# EAGLE design sigfox_pcb (EAGLE 9.5.2)
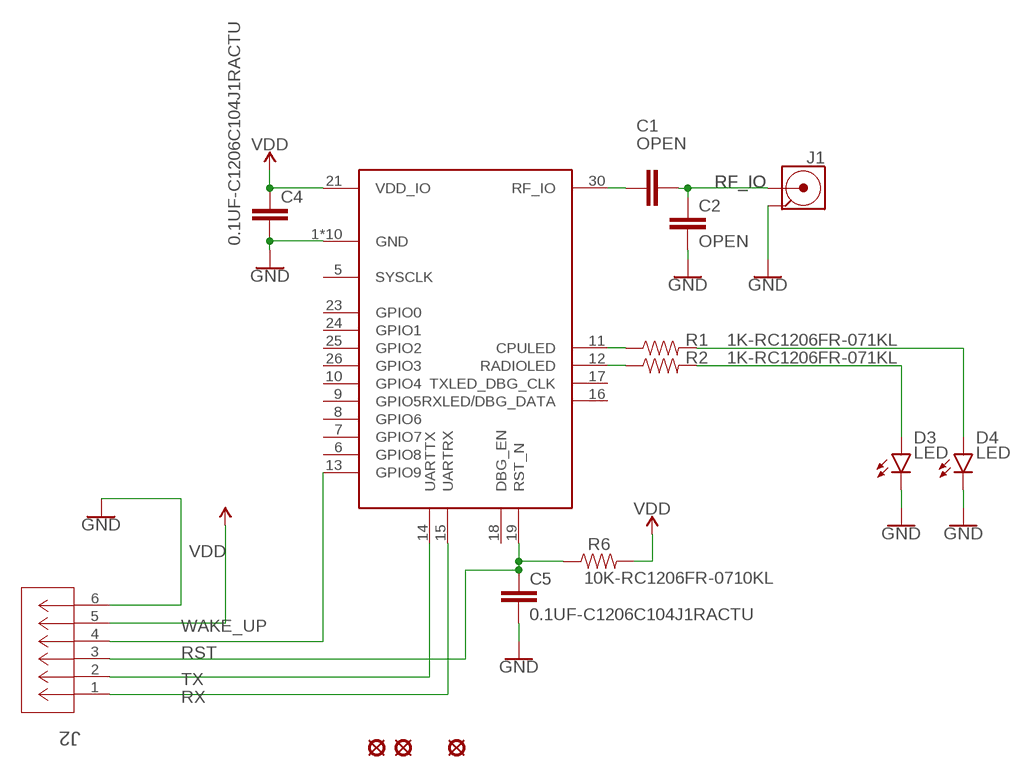
[diagram p0: schematic, sheet 1]

## Parts
C1  OPEN  [C1206_OPEN]
C2  OPEN  [C1206_OPEN]
C4  0.1UF-C1206C104J1RACTU  [C1206]
C5  0.1UF-C1206C104J1RACTU  [C1206]
D3  LED  [LED1206]
D4  LED  [LED1206]
H1  HOLE-M3  [HOLE_3.0]
H2  HOLE-M3  [HOLE_3.0]
H4  HOLE-M3  [HOLE_3.0]
J1  SMA-142-0701-801  [142-0701-801]
J2  SSW-106-02-G-S-RA  [CON6_1X6_TR_SSQ]
R1  1K-RC1206FR-071KL  [R1206]
R2  1K-RC1206FR-071KL  [R1206]
R6  10K-RC1206FR-0710KL  [R1206]
U1  SFM11R2D  [SFM11R2D]

## Nets
GND: C2.2 C4.2 C5.2 D3.K(C) D4.K(C) J1.2_1 J1.2_2 J1.3_1 J1.3_2 J2.6 U1.1(GND) U1.2(GND) U1.3(GND) U1.4(GND) U1.20(GND) U1.22(GND) U1.27(GND) U1.28(GND) U1.29(GND) U1.31(GND)
N$1: R1.1 U1.11(CPULED)
N$2: R2.1 U1.12(RADIOLED)
N$10: D3.A R2.2
N$11: D4.A R1.2
N$12: C1.1 U1.30(RF_IO)
RF_IO: C1.2 C2.1 J1.1
RST: C5.1 J2.3 R6.1 U1.19(RST_N)
RX: J2.1 U1.15(UARTRX)
TX: J2.2 U1.14(UARTTX)
VDD: C4.1 J2.5 R6.2 U1.21(VDD_IO)
WAKE_UP: J2.4 U1.13(GPIO9)
Unconnected: U1.5(SYSCLK) U1.6(GPIO8) U1.7(GPIO7) U1.8(GPIO6) U1.9(GPIO5) U1.10(GPIO4) U1.16(RXLED/DBG_DATA) U1.17(TXLED_DBG_CLK) U1.18(DBG_EN) U1.23(GPIO0) U1.24(GPIO1) U1.25(GPIO2) U1.26(GPIO3)

## Library data of the parts
C1 C2 = untitled-capacitors:OPEN
C4 C5 = untitled-capacitors:0.1UF: 0.1µF Ceramic Capacitor; DIGIKEY#: 399-9304-1-ND; MFR: KEMET; MFR#: C1206C104J1RACTU
D3 D4 = untitled-discretesemi:LED: LED Indication - Discrete Radial
H1 H2 H4 = untitled:HOLE: Hole
J1 = IFUNAM-Connectors:SMA: SMA Connector Jack, Female Socket 50 Ohm; DIGIKEY#: J502-ND; MFR: Cinch Connectivity Solutions Johnson; MFR#: 142-0701-801
J2 = SSW-106-02-G_S_RA:SSW-106-02-G-S-RA; BUILT_BY: EMA_UL_Team; MANUFACTURER_PART_NUMBER: SSW-106-02-G-S-RA; VENDOR: Samtec Inc
R1 R2 = untitled-resistors:1K: Resistor, 1 kohm; DIGIKEY#: 311-1.00KFRCT-ND; MFR: Yageo; MFR#: RC1206FR-071KL
R6 = untitled-resistors:10K: Resistor, 10 kohm; DIGIKEY#: 311-10.0KFRCT-ND; MFR: Yageo; MFR#: RC1206FR-0710KL
U1 = SFM11R2D:SFM11R2D

## Board
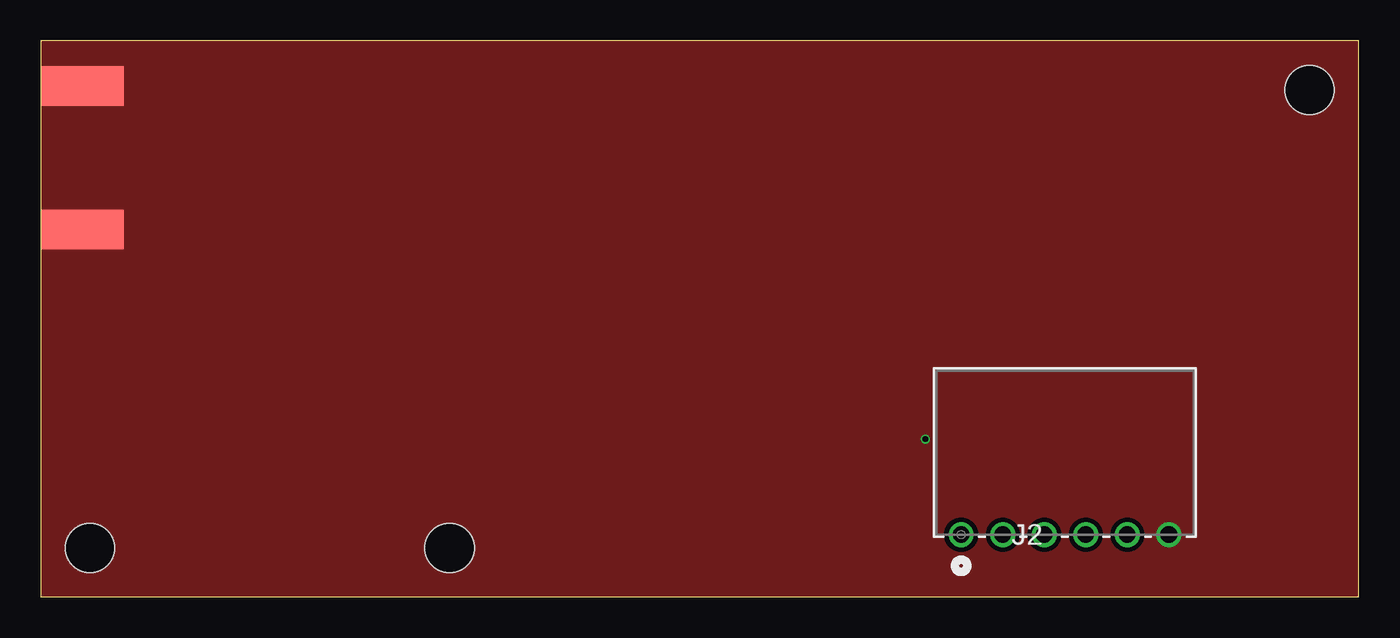
[diagram p1: board, top side]
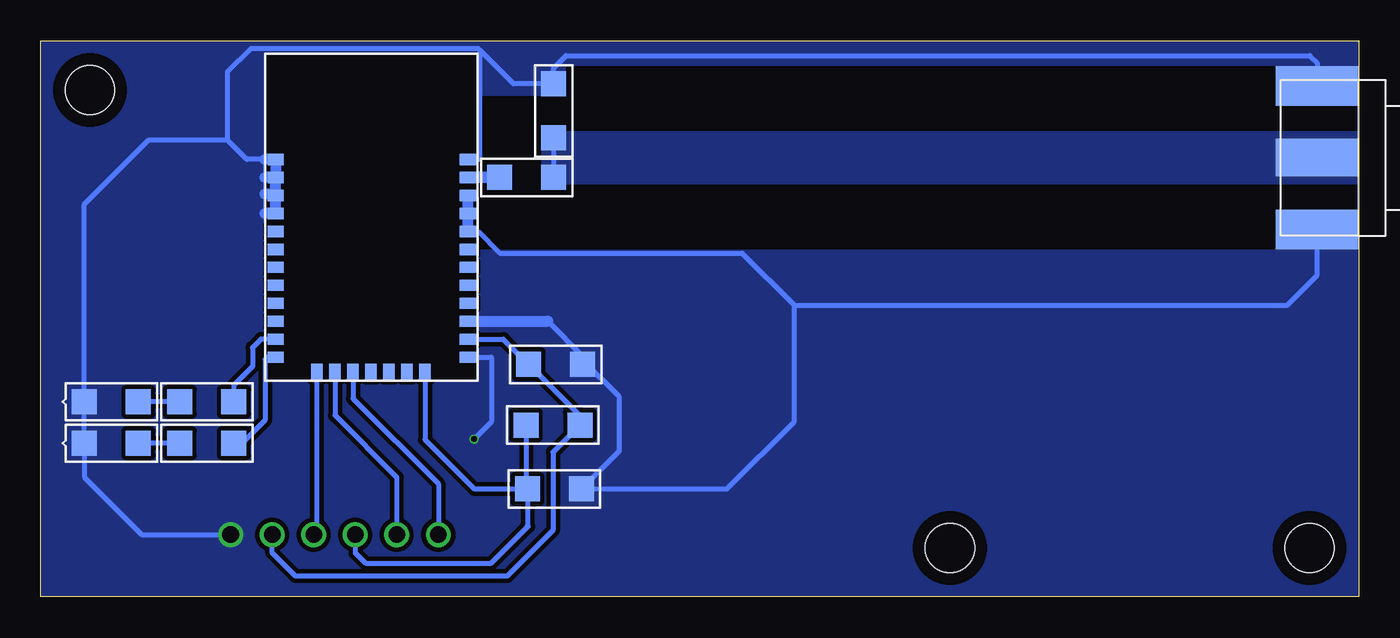
[diagram p2: board, bottom side, seen from below]

Size 80.6 x 34 mm. Coordinates in mm from the lower left corner, seen from the top.
Outline: 80.6,34 0,34 0,0 80.6,0 80.6,34
Copper layers (1*16): Top 0.035mm / dielectric 1.5mm / Bottom 0.035mm
Design rules "SeeedStudio_4layer_DRU_no_angle_20140221 *": minimum track width 5mil, minimum drill 12mil, track to track 11mil, track to pad 11mil, pad to pad 11mil, via to via 11mil, smd to smd 11mil, copper to edge 0mil, drill to drill 8mil, minimum pad ring 6mil, minimum via ring 4mil, stop-mask expansion 4mil, vias tented up to drill 25mil, thermal gap 10mil
bRestrict: area 0,13.2 to 66.9,33.2

### Footprints (pad centres in the part's own frame; a part is rotated, then mirrored left to right if it is on the bottom)
C1206_OPEN = smd 1.524 x 1.524: 1 -1.651,0; 2 1.651,0
C1206 = smd 1.524 x 1.524: 1 -1.651,0; 2 1.651,0
LED1206 = smd 1.524 x 1.524: A 1.651,0; K -1.651,0
HOLE_3.0 = hole 3: 0,0
142-0701-801 = smd 2.286 x 5.08: 1 0,2.54 | smd 2.413 x 5.08: 2_1 -4.381,2.54; 3_1 4.381,2.54 | smd 2.413 x 5.08 bottom: 2_2 -4.381,2.54; 3_2 4.381,2.54
CON6_1X6_TR_SSQ = drill 1.016 pad 1.524: 1 -6.35,0; 2 -3.81,0; 3 -1.27,0; 4 1.27,0; 5 3.81,0; 6 6.35,0
R1206 = smd 1.524 x 1.524: 1 -1.651,0; 2 1.651,0
SFM11R2D = smd 1 x 0.7: 1 0.65,13.55; 2 0.65,12.45; 3 0.65,11.35; 4 0.65,10.25; 5 0.65,9.15; 6 0.65,8.05; 7 0.65,6.95; 8 0.65,5.85; 9 0.65,4.75; 10 0.65,3.65; 11 0.65,2.55; 12 0.65,1.45; 20 12.4,1.45; 21 12.4,2.55; 22 12.4,3.65; 23 12.4,4.75; 24 12.4,5.85; 25 12.4,6.95; 26 12.4,8.05; 27 12.4,9.15; 28 12.4,10.25; 29 12.4,11.35; 30 12.4,12.45; 31 12.4,13.55 | smd 0.7 x 1: 13 3.18,0.56; 14 4.28,0.56; 15 5.38,0.56; 16 6.48,0.56; 17 7.58,0.56; 18 8.68,0.56; 19 9.78,0.56

### Placement (x,y rotation side)
C1  50.89,25.65 0 bottom
C2  49.24,29.72 90 bottom
C4  49.11,14.22 0 bottom
C5  49.19,6.6 0 bottom
D3  76.29,9.4 0 bottom
D4  76.29,11.94 0 bottom
H1  3,3 0 top
H2  77.6,31 0 top
H4  25,3 0 top
J1  0,26.86 90 bottom
J2  62.64,3.81 0 top
R1  70.45,11.94 180 bottom
R2  70.45,9.4 180 bottom
R6  49.28,10.5 0 bottom
U1  66.89,13.21 0 bottom

### Tracks (layer width: path | path; a pad name or v marks a point on that pad's centre or on a via)
GND  (via drill 0.35)
  Bottom 0.127: 66.9,23.46 66.9,24.64 66.9,25.65 66.9,26.76 | U1.2 | U1.3 66.32,24.64
  Bottom 0.152: D3.K 77.94,9.65
  Bottom 0.305: 47.46,14.48 C4.2 47.75,13.93 | 47.46,14.48 47.46,14.73 49.59,16.86 | U1.31 53.83,26.76 53.75,26.84 53.75,33.43 | U1.27 53.86,22.36 52.53,21.03 37.71,21.03 34.52,17.84 34.51,17.84 | 77.94,9.65 D4.K 77.94,24 74,27.94 69.19,27.94 | J1.3_2 2.54,32.66 2.97,33.1 48.48,33.1 49.24,32.34 C2.2 51.69,31.37 53.75,33.43 | 34.51,17.84 4.37,17.84 2.54,19.68 J1.2_2 | 34.51,17.84 34.51,10.72 38.63,6.6 C5.2 45.21,8.93 45.21,12.23 47.46,14.48 | 69.19,27.94 | 69.19,27.94 69.19,32.09 67.75,33.53 53.85,33.53 53.75,33.43 | 69.19,27.94 68.01,26.76 U1.1 | D3.K 77.94,7.33 74.42,3.81 J2.6 | U1.20 53.06,14.66 53.03,14.63 53.03,10.72 v54.1,9.65
  Bottom 0.686: U1.22 49.59,16.86 | U1.29 U1.28 U1.27 | 66.9,26.76 U1.1 U1.2 U1.3 U1.4 66.9,23.46 | U1.2 66.9,25.65 | 66.32,24.64 66.9,24.64
  pour Bottom (rank 2, no thermals): 80.6,0 0,0 0,34 80.6,34
  pour Top (no thermals): 0,34 0,0 80.6,0 80.6,34
N$1
  Bottom 0.305: U1.11 67.14,15.76 67.65,15.24 67.65,14.1 68.8,12.95 R1.1
N$2
  Bottom 0.305: U1.12 66.75,14.66 66.89,14.52 66.89,10.79 68.29,9.4 R2.1
N$10
  Bottom 0.305: R2.2 D3.A
N$11
  Bottom 0.305: R1.2 D4.A
N$12
  Bottom 0.305: U1.30
  Bottom 0.706: U1.30 C1.1
RF_IO
  Bottom 0.305: C2.1 C1.2
  pour Bottom (no thermals): 0,28.51 0,25.21 50,25.21 50,28.51
RST
  Bottom 0.305: 57.31,13.56 U1.19 57.11,9.61 54.1,6.6 C5.1 | R6.1 50.93,6.69 C5.1 | C5.1 50.84,4.36 50.8,4.32 53.09,2.03 60.71,2.03 61.37,2.69 J2.3
RX
  Bottom 0.305: U1.15 61.51,12.13 56.29,6.91 J2.1
TX
  Bottom 0.305: U1.14 62.61,11.1 58.83,7.32 58.83,4.85 | 58.83,4.85 58.83,3.91 | 58.83,4.85 J2.2
VDD
  Bottom 0.305: U1.21 52.32,15.76 50.79,14.22 C4.1 47.62,11.09 R6.2 49.28,8.85 49.28,4.06 52.07,1.27 65.02,1.27 66.45,2.69 J2.5
WAKE_UP
  Bottom 0.305: 63.71,13.61 U1.13 63.71,4.01 J2.4